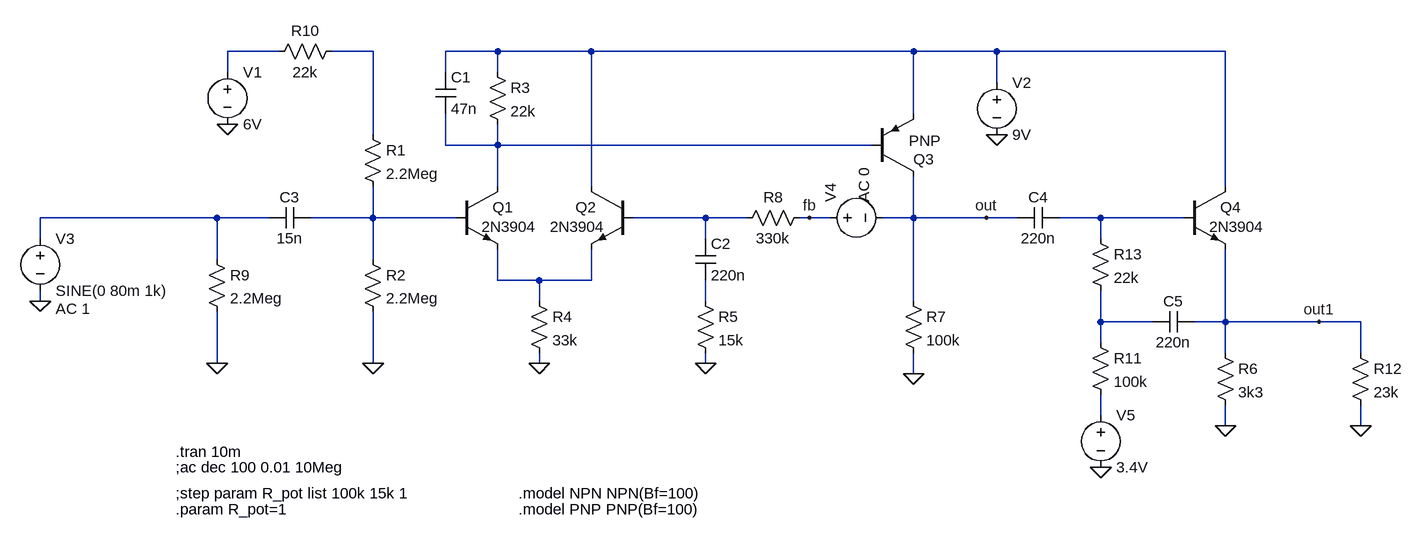
[diagram p0: schematic input.asc]
input.asc, the LTspice schematic file:
Version 4
SHEET 1 1604 680
WIRE -128 -80 -208 -80
WIRE 16 -80 -48 -80
WIRE 208 -80 128 -80
WIRE 352 -80 208 -80
WIRE 848 -80 352 -80
WIRE 976 -80 848 -80
WIRE 1328 -80 976 -80
WIRE -208 -48 -208 -80
WIRE 128 -48 128 -80
WIRE 208 -48 208 -80
WIRE 976 -32 976 -80
WIRE 848 16 848 -80
WIRE 16 48 16 -80
WIRE 128 64 128 16
WIRE 208 64 208 32
WIRE 208 64 128 64
WIRE 784 64 208 64
WIRE 208 128 208 64
WIRE 352 128 352 -80
WIRE 1328 128 1328 -80
WIRE -224 176 -496 176
WIRE -144 176 -224 176
WIRE 16 176 16 128
WIRE 16 176 -80 176
WIRE 144 176 16 176
WIRE 528 176 416 176
WIRE 592 176 528 176
WIRE 688 176 672 176
WIRE 720 176 688 176
WIRE 848 176 848 112
WIRE 848 176 800 176
WIRE 960 176 848 176
WIRE 1008 176 960 176
WIRE 1136 176 1072 176
WIRE 1264 176 1136 176
WIRE -496 208 -496 176
WIRE 528 208 528 176
WIRE 1136 208 1136 176
WIRE -224 240 -224 176
WIRE 16 240 16 176
WIRE 208 272 208 224
WIRE 272 272 208 272
WIRE 352 272 352 224
WIRE 352 272 272 272
WIRE -496 304 -496 288
WIRE 272 304 272 272
WIRE 528 304 528 272
WIRE 848 304 848 176
WIRE 1136 336 1136 288
WIRE 1216 336 1136 336
WIRE 1328 336 1328 224
WIRE 1328 336 1280 336
WIRE 1472 336 1328 336
WIRE 1536 336 1472 336
WIRE 1136 368 1136 336
WIRE 1328 384 1328 336
WIRE 1536 384 1536 336
WIRE -224 400 -224 320
WIRE 16 400 16 320
WIRE 272 400 272 384
WIRE 528 400 528 384
WIRE 848 416 848 384
WIRE 1136 480 1136 448
WIRE 1328 496 1328 464
WIRE 1536 496 1536 464
FLAG 272 400 0
FLAG 16 400 0
FLAG 528 400 0
FLAG 848 416 0
FLAG -208 32 0
FLAG 976 48 0
FLAG -496 304 0
FLAG 960 176 out
FLAG 688 176 fb
FLAG -224 400 0
FLAG 1328 496 0
FLAG 1136 560 0
FLAG 1536 496 0
FLAG 1472 336 out1
SYMBOL res 0 32 R0
SYMATTR InstName R1
SYMATTR Value 2.2Meg
SYMBOL res 0 224 R0
SYMATTR InstName R2
SYMATTR Value 2.2Meg
SYMBOL res 192 -64 R0
SYMATTR InstName R3
SYMATTR Value 22k
SYMBOL res 256 288 R0
SYMATTR InstName R4
SYMATTR Value 33k
SYMBOL res 512 288 R0
SYMATTR InstName R5
SYMATTR Value 15k
SYMBOL res 832 288 R0
SYMATTR InstName R7
SYMATTR Value 100k
SYMBOL res 688 160 R90
WINDOW 0 0 56 VBottom 2
WINDOW 3 32 56 VTop 2
SYMATTR InstName R8
SYMATTR Value 330k
SYMBOL npn 144 128 R0
WINDOW 3 39 62 Left 2
SYMATTR Value 2N3904
SYMATTR InstName Q1
SYMBOL npn 416 128 M0
WINDOW 3 43 62 Left 2
SYMATTR Value 2N3904
SYMATTR InstName Q2
SYMBOL pnp 784 112 M180
WINDOW 0 64 26 Left 2
WINDOW 3 57 55 Left 2
SYMATTR InstName Q3
SYMBOL cap 112 -48 R0
SYMATTR InstName C1
SYMATTR Value 47n
SYMBOL cap 512 208 R0
SYMATTR InstName C2
SYMATTR Value 220n
SYMBOL voltage -208 -64 R0
WINDOW 123 0 0 Left 0
WINDOW 39 0 0 Left 0
SYMATTR InstName V1
SYMATTR Value 6V
SYMBOL voltage 976 -48 R0
WINDOW 123 0 0 Left 0
WINDOW 39 0 0 Left 0
SYMATTR InstName V2
SYMATTR Value 9V
SYMBOL cap -80 160 R90
WINDOW 0 0 32 VBottom 2
WINDOW 3 32 32 VTop 2
SYMATTR InstName C3
SYMATTR Value 15n
SYMBOL voltage -496 192 R0
WINDOW 123 24 124 Left 2
WINDOW 39 0 0 Left 0
SYMATTR Value2 AC 1
SYMATTR InstName V3
SYMATTR Value SINE(0 80m 1k)
SYMBOL voltage 704 176 R270
WINDOW 123 24 68 Left 2
WINDOW 39 0 0 Left 0
SYMATTR Value2 AC 0
SYMATTR InstName V4
SYMATTR Value ""
SYMBOL res -240 224 R0
SYMATTR InstName R9
SYMATTR Value 2.2Meg
SYMBOL res -32 -96 R90
WINDOW 0 0 56 VBottom 2
WINDOW 3 32 56 VTop 2
SYMATTR InstName R10
SYMATTR Value 22k
SYMBOL npn 1264 128 R0
WINDOW 3 39 62 Left 2
SYMATTR Value 2N3904
SYMATTR InstName Q4
SYMBOL cap 1072 160 R90
WINDOW 0 0 32 VBottom 2
WINDOW 3 32 32 VTop 2
SYMATTR InstName C4
SYMATTR Value 220n
SYMBOL res 1312 368 R0
SYMATTR InstName R6
SYMATTR Value 3k3
SYMBOL res 1120 352 R0
SYMATTR InstName R11
SYMATTR Value 100k
SYMBOL voltage 1136 464 R0
WINDOW 123 0 0 Left 0
WINDOW 39 0 0 Left 0
SYMATTR InstName V5
SYMATTR Value 3.4V
SYMBOL res 1520 368 R0
SYMATTR InstName R12
SYMATTR Value 23k
SYMBOL cap 1280 320 R90
WINDOW 0 0 32 VBottom 2
WINDOW 3 32 32 VTop 2
SYMATTR InstName C5
SYMATTR Value 220n
SYMBOL res 1120 192 R0
SYMATTR InstName R13
SYMATTR Value 22k
TEXT -288 536 Left 2 !.tran 10m
TEXT -288 600 Left 2 !;step param R_pot list 100k 15k 1
TEXT -288 560 Left 2 !;ac dec 100 0.01 10Meg
TEXT 240 600 Left 2 !.model NPN NPN(Bf=100)
TEXT 240 624 Left 2 !.model PNP PNP(Bf=100)
TEXT -288 624 Left 2 !.param R_pot=1

The netlist it stands for:
* input.asc
R1 N002 N006 2.2Meg
R2 N006 0 2.2Meg
R3 N003 N004 22k
R4 N009 0 33k
R5 N010 0 15k
R7 out 0 100k
R8 fb N007 330k
Q1 N004 N006 N009 0 2N3904
Q2 N003 N007 N009 0 2N3904
Q3 out N004 N003 0 PNP
C1 N003 N004 47n
C2 N007 N010 220n
V1 N001 0 6V
V2 N003 0 9V
C3 N006 N005 15n
V3 N005 0 SINE(0 80m 1k) AC 1
V4 fb out AC 0
R9 N005 0 2.2Meg
R10 N002 N001 22k
Q4 N003 N008 out1 0 2N3904
C4 N008 out 220n
R6 out1 0 3k3
R11 N011 N012 100k
V5 N012 0 3.4V
R12 out1 0 23k
C5 out1 N011 220n
R13 N008 N011 22k
.model NPN NPN
.model PNP PNP
.lib standard.bjt
.tran 10m
;step param R_pot list 100k 15k 1
;ac dec 100 0.01 10Meg
.model NPN NPN(Bf=100)
.model PNP PNP(Bf=100)
.param R_pot=1
.backanno
.end